# Altium schematic sheet 24V_Load_Switches.SchDoc
size A3; SheetNumber: 10; SheetTotal: 17
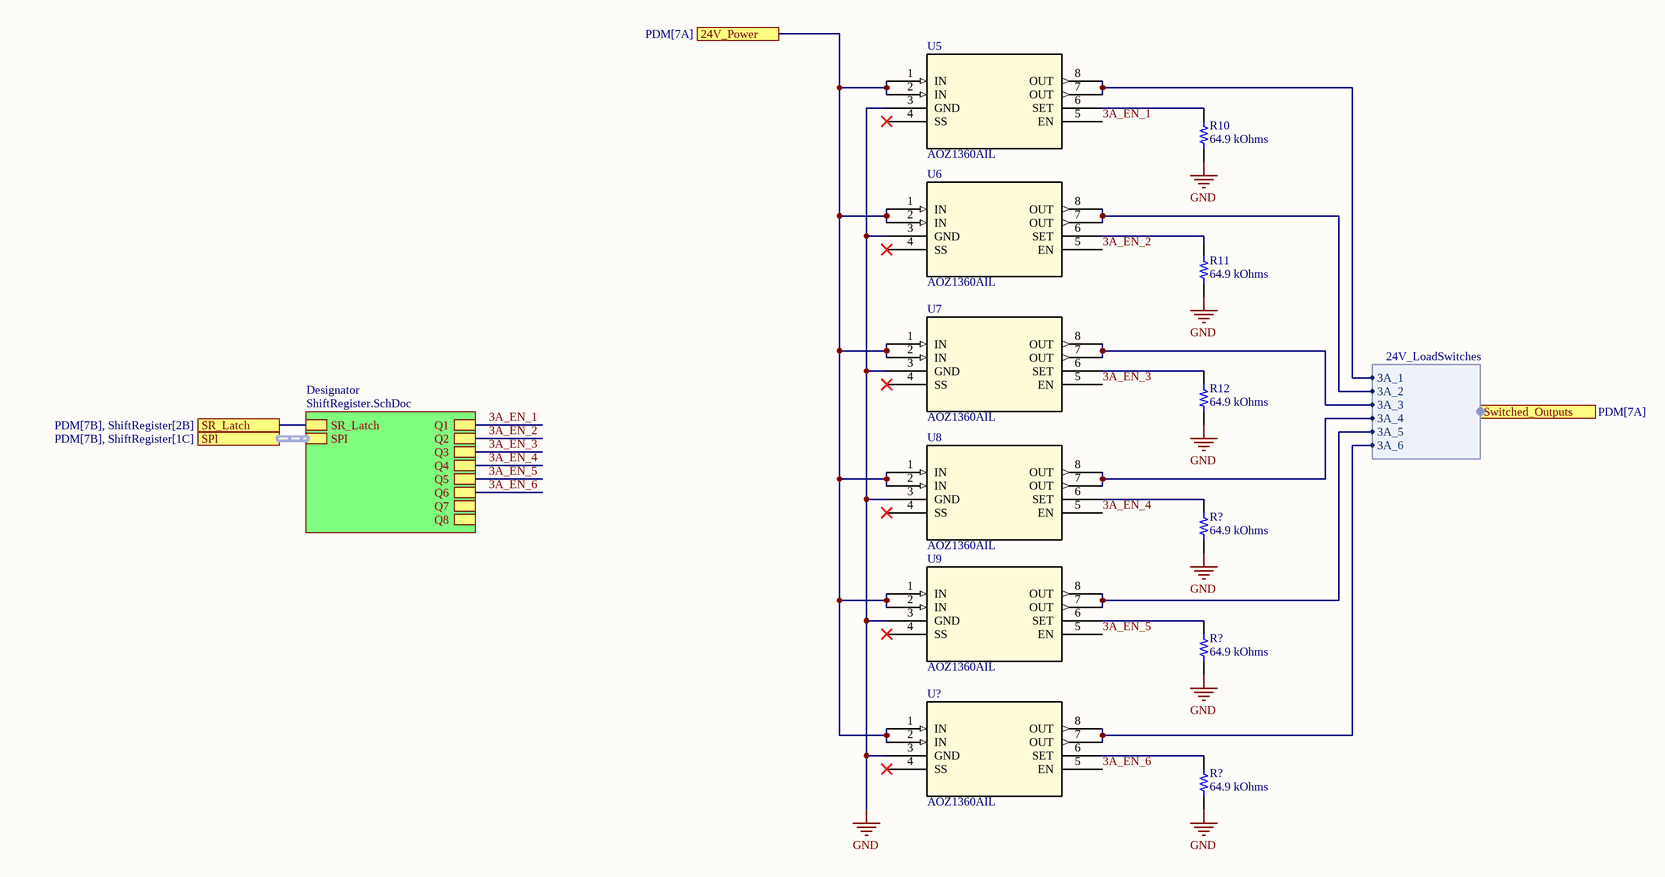
[diagram p0: 24V_Load_Switches.SchDoc]

## Parts
(Parts that share a designator on the sheet are numbered #1, #2 ... from top to bottom, then left to right.)
R10  64.9 kOhms  [RES 0603_1608]
R11  64.9 kOhms  [RES 0603_1608]
R12  64.9 kOhms  [RES 0603_1608]
R?#1  64.9 kOhms  [RES 0603_1608]
R?#2  64.9 kOhms  [RES 0603_1608]
R?#3  64.9 kOhms  [RES 0603_1608]
U5  AOZ1360AIL  [AOZ1360AIL_AOS]
U6  AOZ1360AIL  [AOZ1360AIL_AOS]
U7  AOZ1360AIL  [AOZ1360AIL_AOS]
U8  AOZ1360AIL  [AOZ1360AIL_AOS]
U9  AOZ1360AIL  [AOZ1360AIL_AOS]
U?  AOZ1360AIL  [AOZ1360AIL_AOS]

## Sub-sheets
Designator = ShiftRegister.SchDoc: SPI (harness SPI), SR_Latch, Q1, Q2, Q3, Q4, Q5, Q6, Q8, Q7

## Ports
24V_Power (see PDM[7A]), SPI (harness SPI, see PDM[7B], ShiftRegister[1C]), SR_Latch (see PDM[7B], ShiftRegister[2B]), Switched_Outputs (harness 24V_LoadSwitches, see PDM[7A])

## Harnesses
24V_LoadSwitches: 3A_1, 3A_2, 3A_3, 3A_4, 3A_5, 3A_6

## Nets
GND: R10.1 R11.1 R12.1 R?#1.1 R?#2.1 R?#3.1 U5.3(GND) U6.3(GND) U7.3(GND) U8.3(GND) U9.3(GND) U?.3(GND)
3A_EN_1: U5.5(EN) ; sheet Designator/Q1
3A_EN_2: U6.5(EN) ; sheet Designator/Q2
3A_EN_3: U7.5(EN) ; sheet Designator/Q3
3A_EN_4: U8.5(EN) ; sheet Designator/Q4
3A_EN_5: U9.5(EN) ; sheet Designator/Q5
3A_EN_6: U?.5(EN) ; sheet Designator/Q6
24V_Power: U5.1(IN) U5.2(IN) U6.1(IN) U6.2(IN) U7.1(IN) U7.2(IN) U8.1(IN) U8.2(IN) U9.1(IN) U9.2(IN) U?.1(IN) U?.2(IN) ; port 24V_Power
SR_Latch: port SR_Latch, sheet Designator/SR_Latch
NetR10_2: R10.2 U5.6(SET)
NetR11_2: R11.2 U6.6(SET)
NetR12_2: R12.2 U7.6(SET)
NetR?#1_2: R?#1.2 U8.6(SET)
NetR?#2_2: R?#2.2 U9.6(SET)
NetR?#3_2: R?#3.2 U?.6(SET)
NetU5_7: U5.7(OUT) U5.8(OUT) ; port Switched_Outputs.3A_1
NetU6_7: U6.7(OUT) U6.8(OUT) ; port Switched_Outputs.3A_2
NetU7_7: U7.7(OUT) U7.8(OUT) ; port Switched_Outputs.3A_3
NetU8_7: U8.7(OUT) U8.8(OUT) ; port Switched_Outputs.3A_4
NetU9_7: U9.7(OUT) U9.8(OUT) ; port Switched_Outputs.3A_5
NetU?_7: U?.7(OUT) U?.8(OUT) ; port Switched_Outputs.3A_6

Not connected (* = marked no-connect by the designer): U5 4(SS)*; U6 4(SS)*; U7 4(SS)*; U8 4(SS)*; U9 4(SS)*; U? 4(SS)*

## Buses and harness runs
harness port SPI = sheet Designator/SPI

## Library data of the parts
R10-R12 R?#1-R?#3 = 7-2176089-3: RES SMD 64.9K OHM 0.1% 1/6W 0603; Manufacturer: TE Connectivity Passive Product; Power (Watts): 0.167W, 1/6W; Temperature Coefficient: ±25ppm/°C; Part Number: 7-2176089-3; Value: 64.9 kOhms; ComponentLink1Description: Datasheet; ComponentLink1URL: https://www.te.com/commerce/DocumentDelivery/DDEController?Action=srchrtrv&DocNm=1773272&DocType=DS&DocLang=English; ComponentLink2Description: DigiKey Link; ComponentLink2URL: https://www.digikey.com/en/products/detail/te-connectivity-passive-product/7-2176089-3/4033750; Composition: Thin Film; Device Package: 0603 (1608 Metric); Height - Seated (Max): 0.022" (0.55mm); LastUpdated: 12/19/2023 8:39:23 PM; Lifecycle Status: Active; Minimum Order: 1; Number of Terminations: 2; Operating Temperature: -55°C ~ 155°C; Package / Case: 0603 (1608 Metric); Packaging: TapeAndReel; PartId: 23912; Part Status: Active; Price: 0.14; Resistance: 64.9 kOhms; Series: RP73P, Holsworthy; Size / Dimension: 0.061" L x 0.031" W (1.55mm x 0.80mm); Supplier 1: DigiKey; Supplier Part Number 1: A110282CT-ND; Supplier Device Package: 0603; Tolerance: ±0.1%
U5-U9 U? = AOZ1360AIL: No Description Available; Mfr_Name: Alpha and Omega Semiconductor; Copyright: Copyright (C) 2023 Ultra Librarian. All rights reserved.; Manufacturer_Part_Number: AOZ1360AIL; RefDes: RefDes; Type: DEV